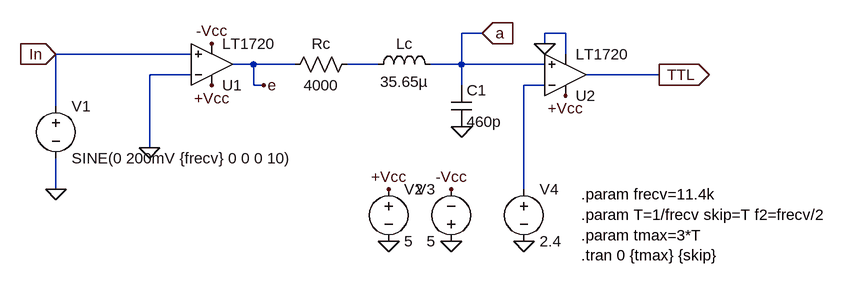
[diagram p0: schematic Draft3.asc]
Draft3.asc, the LTspice schematic file:
Version 4
SHEET 1 1048 680
WIRE 464 112 432 112
WIRE 592 112 560 112
WIRE 560 128 560 112
WIRE 16 144 -192 144
WIRE 592 144 592 112
WIRE 112 160 80 160
WIRE 176 160 112 160
WIRE 304 160 256 160
WIRE 432 160 432 112
WIRE 432 160 384 160
WIRE 560 160 432 160
WIRE 16 176 -48 176
WIRE 736 176 624 176
WIRE 112 192 112 160
WIRE 128 192 112 192
WIRE 432 192 432 160
WIRE 560 192 528 192
WIRE -192 224 -192 144
WIRE -48 288 -48 176
WIRE -192 352 -192 304
WIRE 528 352 528 192
FLAG -48 288 0
FLAG -192 352 0
FLAG -192 144 In
IOPIN -192 144 In
FLAG 416 432 0
FLAG 320 432 0
FLAG 320 352 +Vcc
FLAG 416 352 -Vcc
FLAG 48 192 +Vcc
FLAG 48 128 -Vcc
FLAG 464 112 a
IOPIN 464 112 In
FLAG 432 256 0
FLAG 560 128 0
FLAG 592 208 +Vcc
FLAG 528 432 0
FLAG 736 176 TTL
IOPIN 736 176 Out
FLAG 128 192 e
SYMBOL Comparators\\LT1720 48 224 M180
SYMATTR InstName U1
SYMBOL voltage -192 208 R0
WINDOW 123 0 0 Left 0
WINDOW 39 0 0 Left 0
SYMATTR InstName V1
SYMATTR Value SINE(0 200mV {frecv} 0 0 0 10)
SYMBOL voltage 320 336 R0
SYMATTR InstName V2
SYMATTR Value 5
SYMBOL voltage 416 448 R180
WINDOW 0 24 96 Left 2
WINDOW 3 24 16 Left 2
SYMATTR InstName V3
SYMATTR Value 5
SYMBOL res 272 144 R90
WINDOW 0 0 56 VBottom 2
WINDOW 3 32 56 VTop 2
SYMATTR InstName Rc
SYMATTR Value 4000
SYMBOL ind 288 176 R270
WINDOW 0 32 56 VTop 2
WINDOW 3 5 56 VBottom 2
SYMATTR InstName Lc
SYMATTR Value 35.65µ
SYMBOL cap 416 192 R0
SYMATTR InstName C1
SYMATTR Value 460p
SYMBOL Comparators\\LT1720 592 240 M180
SYMATTR InstName U2
SYMBOL voltage 528 336 R0
SYMATTR InstName V4
SYMATTR Value 2.4
TEXT 616 360 Left 2 !.param frecv=11.4k\n.param T=1/frecv skip=T f2=frecv/2\n.param tmax=3*T\n.tran 0 {tmax} {skip}

The netlist it stands for:
* Draft3.asc
XU1 In 0 +Vcc -Vcc e LT1720  ; pins In+ In- V+ V- OUT
V1 In 0 SINE(0 200mV {frecv} 0 0 0 10)
V2 +Vcc 0 5
V3 0 -Vcc 5
Rc N001 e 4000
Lc N001 a 35.65µ
C1 a 0 460p
XU2 a N002 +Vcc 0 TTL LT1720  ; pins In+ In- V+ V- OUT
V4 N002 0 2.4
.param frecv=11.4k
.param T=1/frecv skip=T f2=frecv/2
.param tmax=3*T
.tran 0 {tmax} {skip}
.lib LT1720.sub
.backanno
.end